# EAGLE board MKR_IMU_GPS_C_loop_v1 (2) (EAGLE 9.6.2)
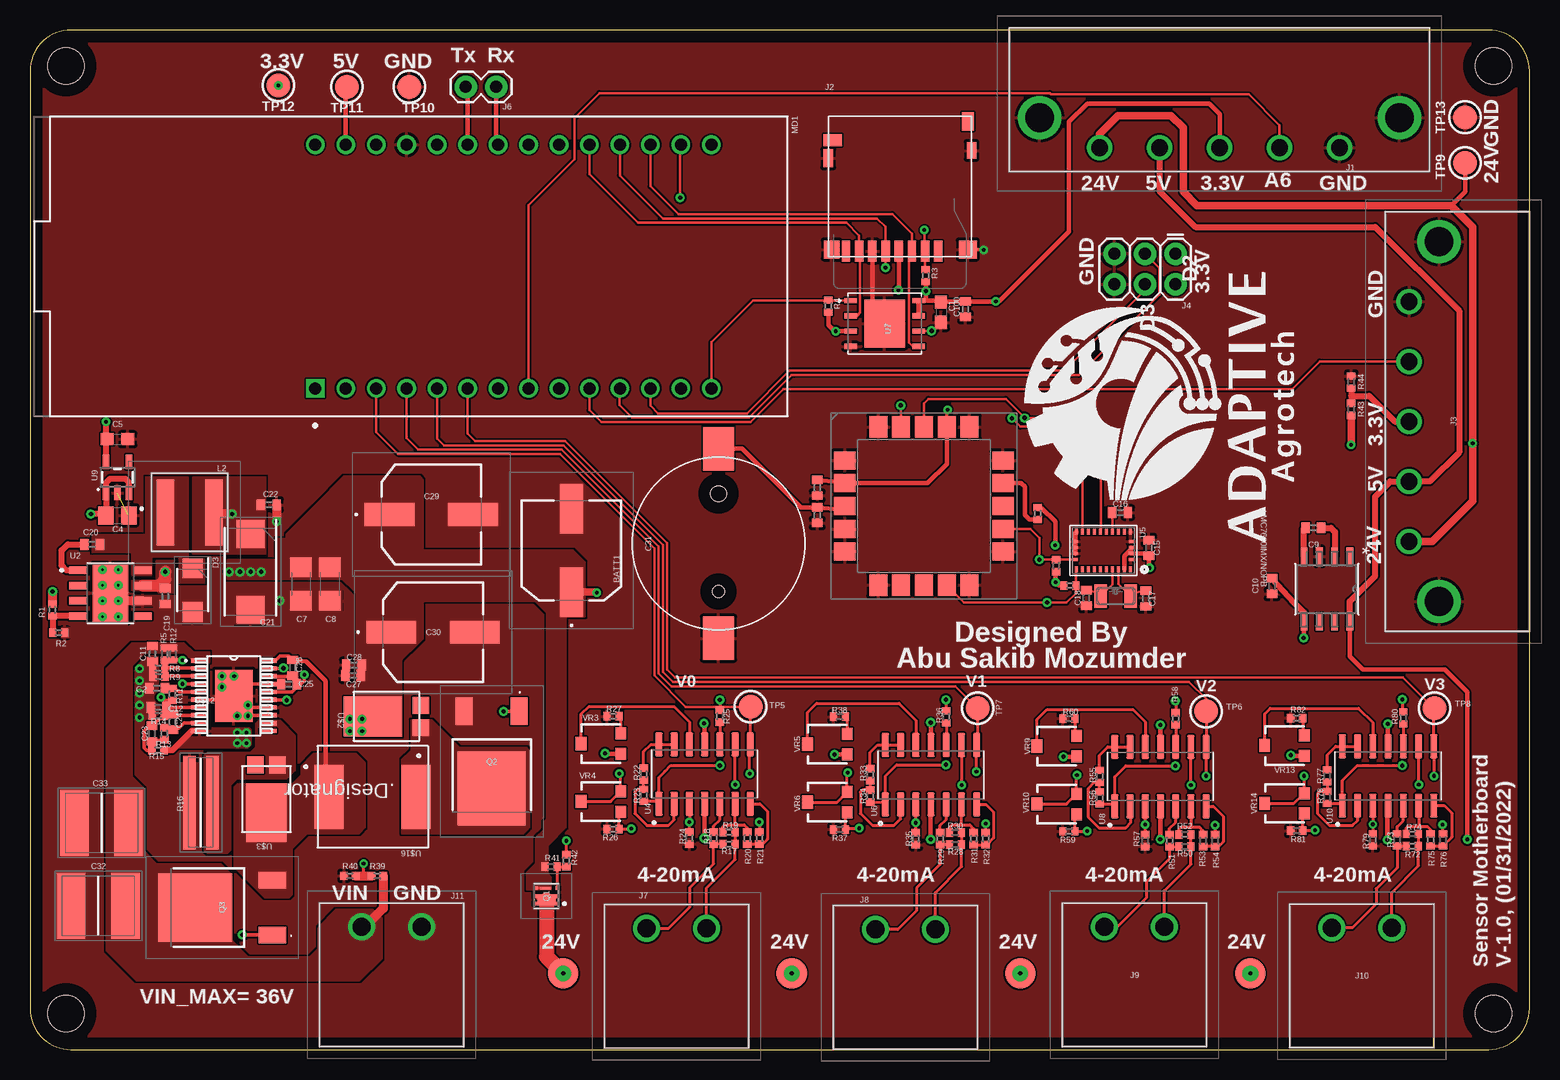
[diagram p5: board, top side]
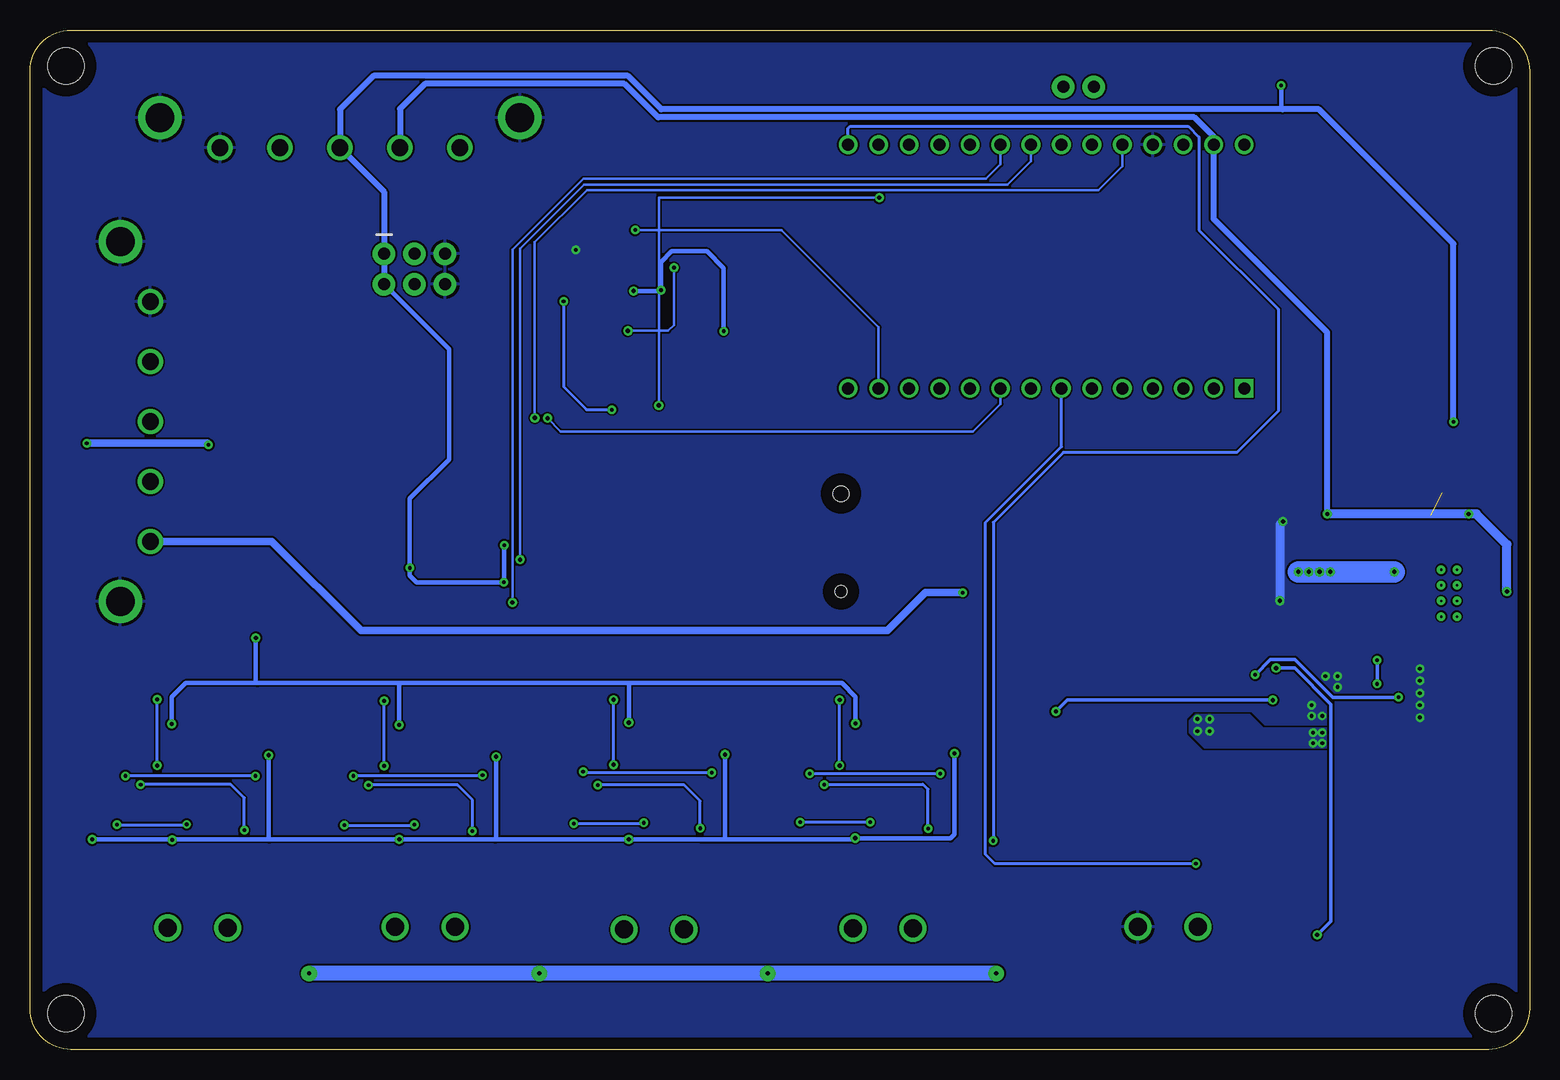
[diagram p6: board, bottom side, seen from below]

Size 125 x 85 mm. Coordinates in mm from the lower left corner, seen from the top.
Outline: 0,81.59 0,3.41 arc90 3.41,0 121.59,0 arc90 125,3.41 125,81.59 arc90 121.59,85 3.41,85 arc90 0,81.59
Copper layers (1*16): Top 0.035mm / dielectric 1.5mm / Bottom 0.035mm
Design rules "default *": minimum track width 6mil, minimum drill 0.3mm, track to track 6mil, track to pad 6mil, pad to pad 6mil, via to via 6mil, smd to smd 6mil, copper to edge 40mil, drill to drill 6mil, minimum pad ring 10mil, minimum via ring 8mil, stop-mask expansion 4mil, vias tented up to drill 20mil, thermal gap 10mil
Holes 3 mm at 3,82 122,82 122,3 3,3

## Footprints (pad centres in the part's own frame; a part is rotated, then mirrored left to right if it is on the bottom)
BATT-HOLDER_12MM = smd 3.6 x 2.6: P$1 -7.9,0; P$2 7.9,0 | hole 1: -4,0 | hole 1.3: 4.15,0
C0603 = smd 1.1 x 1: 1 -0.85,0; 2 0.85,0
C0402 = smd 0.7 x 0.9: 1 -0.65,0; 2 0.65,0
C0805 = smd 1.3 x 1.5: 1 -0.95,0; 2 0.95,0
C1206 = smd 1.6 x 1.8: 1 -1.4,0; 2 1.4,0
CAPPM7343X400N = smd 2.3 x 2.35: 1 -3.15,0; 2 3.15,0
16SVF270M = smd 4.15 x 1.9: 1 -3.475,0; 2 3.475,0
CAPC6050X550N = smd 2.39 x 5.51: 1 -2.26,0; 2 2.26,0
SODFL4626X130N = smd 1.66 x 1.63: 1 -1.825,0; 2 1.825,0
UBLOXLIB_SAM-M8Q = smd 1.8 x 1.5: 1 -6.6,3.8; 2 -6.6,1.9; 3 -6.6,0; 4 -6.6,-1.9; 5 -6.6,-3.8; 11 6.6,-3.8; 12 6.6,-1.9; 13 6.6,0; 14 6.6,1.9; 15 6.6,3.8 | smd 1.5 x 1.8: 6 -3.8,-6.6; 7 -1.9,-6.6; 8 0,-6.6; 9 1.9,-6.6; 10 3.8,-6.6; 16 3.8,6.6; 17 1.9,6.6; 18 0,6.6; 19 -1.9,6.6; 20 -3.8,6.6
1924004 = drill 1.4 pad 2.1: 1 0,0; 2 5,0; 3 10,0; 4 15,0; 5 20,0 | drill 2.4 pad 3.6: MH1 -5,-2.5; MH2 25,-2.5
AMPHENOL_114-00841-68 = smd 0.7 x 1.75: 1 3.2,-5.888; 2 2.1,-5.888; 3 1,-5.888; 4 -0.1,-5.888; 5 -1.2,-5.888; 6 -2.3,-5.888; 7 -3.4,-5.888; 8 -4.5,-5.888 | smd 1 x 1.55: CD1 5.65,4.912 | smd 1.55 x 1: CD2 -5.602,3.337 | smd 1.3 x 1.5: SH1 -5.7,-5.76 | smd 1.5 x 1.5: SH2 5.65,-5.76 | smd 0.8 x 1.4: SH3 5.975,2.487 | smd 0.8 x 1.5: SH4 -5.975,1.837
2X3 = drill 1.016 pad 1.88: 1 0,0; 2 0,2.54; 3 2.54,0; 4 2.54,2.54; 5 5.08,0; 6 5.08,2.54
1X02 = drill 1.016 pad 1.88: 1 0,0; 2 2.54,0
7966442 = drill 1.5 pad 2.25: 1 0,0; 2 5,0
XAL6060153MEC = smd 1.43 x 5.5: 1 -2.02,0; 2 2.02,0
ARDUINO_MKR_WIFI_1010_0 = drill 1 pad 1.55 square: 1 -7.97,-10.16 | drill 1 pad 1.55: 2 -5.43,-10.16; 3 -2.89,-10.16; 4 -0.35,-10.16; 5 2.19,-10.16; 6 4.73,-10.16; 7 7.27,-10.16; 8 9.81,-10.16; 9 12.35,-10.16; 10 14.89,-10.16; 11 17.43,-10.16; 12 19.97,-10.16; 13 22.51,-10.16; 14 25.05,-10.16; 15 25.05,10.16; 16 22.51,10.16; 17 19.97,10.16; 18 17.43,10.16; 19 14.89,10.16; 20 12.35,10.16; 21 9.81,10.16; 22 7.27,10.16; 23 4.73,10.16; 24 2.19,10.16; 25 -0.35,10.16; 26 -2.89,10.16; 27 -5.43,10.16; 28 -7.97,10.16
SQA403EJT1_GE3 = smd 0.3 x 0.35: 1 -0.65,-0.925; 2 0,-0.925; 3 0.65,-0.925; 4 0.65,0.925; 5 0,0.925; 6 -0.65,0.925 | smd 0.235 x 0.87: 7 0.65,0.04 | smd 0.95 x 1.5: 8 -0.325,0
SUD23N0631GE3 = smd 1.397 x 2.286: 1 -2.286,-4.222; 3 2.286,-4.222 | smd 5.69 x 6.18: 2 0,2.213
R0402 = smd 0.6 x 0.7: 1 -0.5,0; 2 0.5,0
RESC2075X70N = smd 1.05 x 7.8: 1 -0.95,0; 2 0.95,0
PAD.03X.05 = smd 2.54 x 2.54: 1 0,0
TESTPOINT_ROUND_2MM = smd 2 x 2: P$1 0,0
CONV_TPS5450DDAR = smd 1.55 x 0.6: 1 -2.7,1.905; 2 -2.7,0.635; 3 -2.7,-0.635; 4 -2.7,-1.905; 5 2.7,-1.905; 6 2.7,-0.635; 7 2.7,0.635; 8 2.7,1.905 | smd 2.95 x 4.9: 9 0,0 | drill 0.2 pad 0.3: 10 -0.65,1.95; 11 0.65,1.95; 12 -0.65,0.65; 13 0.65,0.65; 14 -0.65,-0.65; 15 0.65,-0.65; 16 -0.65,-1.95; 17 0.65,-1.95
M08A_TEX = smd 1.46 x 0.559: 1 -2.724,1.905; 2 -2.724,0.635; 3 -2.724,-0.635; 4 -2.724,-1.905; 5 2.724,-1.905; 6 2.724,-0.635; 7 2.724,0.635; 8 2.724,1.905
SOIC127P600X175-14N = smd 1.97 x 0.6: 1 -2.475,3.81; 2 -2.475,2.54; 3 -2.475,1.27; 4 -2.475,0; 5 -2.475,-1.27; 6 -2.475,-2.54; 7 -2.475,-3.81; 8 2.475,-3.81; 9 2.475,-2.54; 10 2.475,-1.27; 11 2.475,0; 12 2.475,1.27; 13 2.475,2.54; 14 2.475,3.81
BNO055 = smd 0.25 x 0.475: 1 -2.25,1.562; 6 -2.25,-1.562; 7 -1.75,-1.562; 8 -1.25,-1.562; 9 -0.75,-1.562; 10 -0.25,-1.562; 11 0.25,-1.562; 12 0.75,-1.562; 13 1.25,-1.562; 14 1.75,-1.562; 15 2.25,-1.562; 20 2.25,1.562; 21 1.75,1.562; 22 1.25,1.562; 23 0.75,1.562; 24 0.25,1.562; 25 -0.25,1.562; 26 -0.75,1.562; 27 -1.25,1.562; 28 -1.75,1.562 | smd 0.375 x 0.25: 2 -2.312,0.75; 3 -2.312,0.25; 4 -2.312,-0.25; 5 -2.312,-0.75; 16 2.312,-0.75; 17 2.312,-0.25; 18 2.312,0.25; 19 2.312,0.75
SON9P127_500X600X80L60X41T340X400N = smd 0.44 x 1.06: 1 -1.905,-2.835; 2 -0.635,-2.835; 3 0.635,-2.835; 4 1.905,-2.835; 5 1.905,2.835; 6 0.635,2.835; 7 -0.635,2.835; 8 -1.905,2.835 | smd 4 x 3.4: 9 0,0
SOT23-5 = smd 0.55 x 1.2: 1 -0.95,-1.3; 2 0,-1.3; 3 0.95,-1.3; 4 0.95,1.3; 5 -0.95,1.3
POWERDI5 = smd 1.397 x 1.397: 1 -0.92,-2.857; 3 0.92,-2.857 | smd 3.353 x 4.851: 2 0,1.13
MXA20A = smd 1.422 x 0.356: 1 -2.845,2.925; 2 -2.845,2.275; 3 -2.845,1.625; 4 -2.845,0.975; 5 -2.845,0.325; 6 -2.845,-0.325; 7 -2.845,-0.975; 8 -2.845,-1.625; 9 -2.845,-2.275; 10 -2.845,-2.925; 11 2.845,-2.925; 12 2.845,-2.275; 13 2.845,-1.625; 14 2.845,-0.975; 15 2.845,-0.325; 16 2.845,0.325; 17 2.845,0.975; 18 2.845,1.625; 19 2.845,2.275; 20 2.845,2.925 | smd 3.15 x 4.343: 21 0,0
WE-LHMI_8040 = smd 2.42 x 5.33: 1 -3.62,0; 2 3.62,0
TRIMPOT-SMD-3MM-CLOSED = smd 1 x 0.9: 1 -0.85,-1.65; 3 0.85,-1.65 | smd 1.1 x 0.9: 2 0,1.65
ABS07 = smd 1.1 x 1.9: 1 -1.25,0; 2 1.25,0

## Placement (x,y rotation side)
BATT1  BATT-HOLDER_12MM  [BATT-HOLDER_12MM]  57.4,42.18 90 top
C1  10uF  [C0603]  75.95,61.47 270 top
C2  470pF  [C0402]  10.59,30.12 180 top
C4  1.0uF  [C0805]  7.29,44.53 0 top
C5  2.2uF  [C0603]  7.29,50.88 0 top
C7  UMK316ABJ475KL8T  [C1206]  22.58,38.81 270 top
C8  UMK316ABJ475KL8T  [C1206]  24.99,38.81 270 top
C9  10uF  [C0402]  106.98,43.5 180 top
C10  10uF  [C0402]  103.54,38.64 90 top
C11  100nF  [C0402]  10.21,32.99 270 top
C12  22nF  [C0402]  10.72,28.52 180 top
C13  100n  [C0402]  65.63,46.84 270 top
C14  100n  [C0402]  65.63,44.55 270 top
C15  100n  [C0402]  93.27,41.82 90 top
C16  100n  [C0402]  90.87,44.76 0 top
C17  [C0402]  93.01,37.59 90 top
C18  [C0402]  88.06,37.64 90 top
C19  UMF105B7103KVHF  [C0402]  11.28,37.8 270 top
C20  UMF105B7103KVHF  [C0402]  5.18,42.11 0 top
C21  10TPB330M  [CAPPM7343X400N]  18.39,39.83 270 top
C22  UMF105B7103KVHF  [C0402]  19.91,45.42 0 top
C23  33nF  [C0402]  10.16,26.34 90 top
C24  470pF  [C0402]  11.89,27.3 90 top
C25  1uF  [C0402]  21.59,30.45 180 top
C26  100NnF  [C0402]  21.89,31.83 90 top
C27  470nF  [C0402]  26.95,31.19 180 top
C28  470nF  [C0402]  27,32.05 180 top
C29  50SVPF18M  [16SVF270M]  33.45,44.6 0 top
C30  50SVPF18M  [16SVF270M]  33.6,34.8 0 top
C31  50SVPF18M  [16SVF270M]  45.14,41.61 90 top
C32  CKG57NX5R1H226M500JH  [CAPC6050X550N]  5.69,11.99 0 top
C33  CKG57NX5R1H226M500JH  [CAPC6050X550N]  5.97,18.9 0 top
C100  100nF  [C0402]  77.98,61.72 90 top
D3  SS54F  [SODFL4626X130N]  13.56,38.3 270 top
IC2  SAM-M8Q  [UBLOXLIB_SAM-M8Q]  74.52,45.31 0 top
J1  1924004  [1924004]  109.16,75.18 180 top
J2  -  [AMPHENOL_114-00841-68]  72.52,72.47 0 top
J3  1924004  [1924004]  114.97,42.35 90 top
J4  FEMALE 2x3  [2X3]  95.48,66.34 180 top
J6  [1X02]  38.86,80.26 180 top
J7  796644-2  [7966442]  51.41,10.11 0 top
J8  796644-2  [7966442]  70.46,10.01 0 top
J9  796644-2  [7966442]  89.56,10.21 0 top
J10  796644-2  [7966442]  108.51,10.16 0 top
J11  796644-2  [7966442]  27.66,10.21 0 top
L2  XAL6060-153MEC  [XAL6060153MEC]  13.31,44.78 0 top
MD1  ARDUINO_MKR_WIFI_1010ARDUINO_MKR_WIFI_1010_0_0  [ARDUINO_MKR_WIFI_1010_0]  31.75,65.28 0 top
Q1  SQA403EJ-T1_GE3  [SQA403EJT1_GE3]  43.05,12.8 90 top
Q2  SUD23N06-31-GE3  [SUD23N0631GE3]  38.48,23.98 180 top
Q3  SUD23N06-31-GE3  [SUD23N0631GE3]  15.98,11.84 90 top
R1  10K  [R0402]  1.88,36.65 90 top
R2  3.16K  [R0402]  2.39,34.75 180 top
R3  10K  [R0402]  74.68,64.52 270 top
R4  10K  [R0402]  66.55,61.98 270 top
R5  36.5K  [R0402]  11.23,32.97 90 top
R6  10K  [R0402]  86.68,38.68 180 top
R7  10K  [R0402]  85.54,40.33 270 top
R8  6.49K  [R0402]  10.72,31.8 0 top
R9  10K  [R0402]  10.74,31.09 0 top
R10  100k  [R0402]  84.01,44.69 90 top
R11  105K  [R0402]  11.86,29.62 270 top
R12  1m  [R0402]  11.91,32.97 90 top
R13  12.1K  [R0402]  11.2,26.34 90 top
R14  1K  [R0402]  10.69,27.84 180 top
R15  18.7K  [R0402]  10.67,24.94 180 top
R16  10m  [RESC2075X70N]  14.25,20.6 180 top
R17  100R  [R0402]  58.27,17.12 180 top
R18  10K  [R0402]  57,17.63 270 top
R19  10K  [R0402]  58.27,18.14 0 top
R20  10K  [R0402]  59.79,17.63 90 top
R21  10K  [R0402]  60.81,17.63 270 top
R22  10K  [R0402]  51.16,22.96 90 top
R23  10K  [R0402]  51.16,21.18 90 top
R24  10K  [R0402]  54.97,17.63 270 top
R25  10K  [R0402]  57.51,27.79 90 top
R26  10K  [R0402]  48.62,18.39 180 top
R27  200R  [R0402]  48.62,27.79 0 top
R28  100R  [R0402]  77.14,17.07 180 top
R29  10K  [R0402]  75.87,17.58 270 top
R30  10K  [R0402]  77.14,18.08 0 top
R31  10K  [R0402]  78.66,17.58 90 top
R32  10K  [R0402]  79.68,17.58 270 top
R33  10K  [R0402]  70.03,22.91 90 top
R34  10K  [R0402]  70.03,21.13 90 top
R35  10K  [R0402]  73.84,17.58 270 top
R36  10K  [R0402]  76.38,27.74 90 top
R37  10K  [R0402]  67.49,18.34 180 top
R38  200R  [R0402]  67.49,27.74 0 top
R39  1M  [R0402]  28.96,14.48 0 top
R40  75K  [R0402]  26.67,14.48 0 top
R41  10K  [R0402]  43.43,15.24 0 top
R42  470R  [R0402]  44.7,15.75 90 top
R43  820K  [R0402]  110.14,53.37 270 top
R44  120K  [R0402]  110.14,55.66 270 top
R50  100R  [R0402]  96.27,16.92 180 top
R51  10K  [R0402]  95,17.42 270 top
R52  10K  [R0402]  96.27,17.93 0 top
R53  10K  [R0402]  97.79,17.42 90 top
R54  10K  [R0402]  98.81,17.42 270 top
R55  10K  [R0402]  89.15,22.76 90 top
R56  10K  [R0402]  89.15,20.98 90 top
R57  10K  [R0402]  92.96,17.42 270 top
R58  10K  [R0402]  95.5,27.58 90 top
R59  10K  [R0402]  86.61,18.19 180 top
R60  200R  [R0402]  86.61,27.58 0 top
R72  100R  [R0402]  115.24,16.97 180 top
R73  10K  [R0402]  113.97,17.48 270 top
R74  10K  [R0402]  115.24,17.98 0 top
R75  10K  [R0402]  116.76,17.48 90 top
R76  10K  [R0402]  117.78,17.48 270 top
R77  10K  [R0402]  108.13,22.81 90 top
R78  10K  [R0402]  108.13,21.03 90 top
R79  10K  [R0402]  111.94,17.48 270 top
R80  10K  [R0402]  114.48,27.64 90 top
R81  10K  [R0402]  105.59,18.24 180 top
R82  200R  [R0402]  105.59,27.64 0 top
TP1  TEST-POINT3X5  [PAD.03X.05]  44.45,6.35 0 top
TP2  TEST-POINT3X5  [PAD.03X.05]  63.5,6.35 0 top
TP3  TEST-POINT3X5  [PAD.03X.05]  82.55,6.35 0 top
TP4  TEST-POINT3X5  [PAD.03X.05]  101.73,6.35 0 top
TP5  [TESTPOINT_ROUND_2MM]  60.07,28.57 0 top
TP6  [TESTPOINT_ROUND_2MM]  98.04,28.19 0 top
TP7  [TESTPOINT_ROUND_2MM]  78.99,28.45 0 top
TP8  [TESTPOINT_ROUND_2MM]  117.09,28.45 0 top
TP9  [TESTPOINT_ROUND_2MM]  119.63,73.91 0 top
TP10  [TESTPOINT_ROUND_2MM]  31.62,80.26 0 top
TP11  [TESTPOINT_ROUND_2MM]  26.42,80.26 0 top
TP12  [TESTPOINT_ROUND_2MM]  20.7,80.39 0 top
TP13  [TESTPOINT_ROUND_2MM]  119.63,77.72 0 top
U2  TPS5450DDAR  [CONV_TPS5450DDAR]  6.71,38.05 0 top
U3  LMC7660IMX/NOPB  [M08A_TEX]  108.11,38.39 270 top
U4  LM324  [SOIC127P600X175-14N]  56.24,22.96 90 top
U5  BNO055  [BNO055]  89.48,41.6 180 top
U6  LM324  [SOIC127P600X175-14N]  75.11,22.91 90 top
U7  W25Q16  [SON9P127_500X600X80L60X41T340X400N]  71.25,60.53 270 top
U8  LM324  [SOIC127P600X175-14N]  94.23,22.76 90 top
U9  AP2112K-3.3V  [SOT23-5]  7.29,47.7 0 top
U10  LM324  [SOIC127P600X175-14N]  113.21,22.81 90 top
U$2  PDS760-13  [POWERDI5]  29.72,27.76 90 top
U$3  PDS760-13  [POWERDI5]  19.71,20.88 180 top
U$12  LM25118MH/NOPB  [MXA20A]  16.99,29.49 0 top
U$16  74437358082  [WE-LHMI_8040]  28.57,21.06 180 top
VR3  10k  [TRIMPOT-SMD-3MM-CLOSED]  47.6,25.5 90 top
VR4  100K  [TRIMPOT-SMD-3MM-CLOSED]  47.6,20.68 90 top
VR5  10k  [TRIMPOT-SMD-3MM-CLOSED]  66.47,25.45 90 top
VR6  100K  [TRIMPOT-SMD-3MM-CLOSED]  66.47,20.62 90 top
VR9  10k  [TRIMPOT-SMD-3MM-CLOSED]  85.6,25.3 90 top
VR10  100K  [TRIMPOT-SMD-3MM-CLOSED]  85.6,20.47 90 top
VR13  10k  [TRIMPOT-SMD-3MM-CLOSED]  104.57,25.35 90 top
VR14  100K  [TRIMPOT-SMD-3MM-CLOSED]  104.57,20.52 90 top
Y2  32768Hz  [ABS07]  90.49,37.79 180 top

## Tracks (layer width: path | path; a pad name or v marks a point on that pad's centre or on a via)
3.3V  (via drill 0.3, 0.35)
  Top 0.254: IC2.17 76.42,53.27 v76.49,53.34
  Top 0.381: C13.1 67.85,47.29 IC2.2 74.83,47.21 76.42,48.8 IC2.17 | U5.4 91.79,41.7 | 91.79,41.7 U5.3 93.23,41.35 C15.1 93.27,40.22 v93.35,40.15 | R6.2 85.77,38.68 v85.5,38.95 85.5,39.78 R7.2 | U5.28 91.23,41.13 91.79,41.7 | U7.7 U7.8 74.62,62.43 | 74.62,62.43 75.74,62.43 C1.1 76,62.37 C100.2 80.52,62.37 v80.52,62.39 80.8,62.39 86.61,68.2 86.61,77.34 88.14,78.87 98.3,78.87 99.19,77.98 99.19,75.21 J1.3 | R3.2 v74.68,63.25 74.68,62.48 74.62,62.43 | R4.2 66.55,60.4 67.06,59.89 v67.18,59.89 U7.3 | J2.4 72.42,63.35 v72.39,63.32 | R10.2 84.02,45.15 84.33,45.15 85.47,44 v85.47,42.05
  Top 0.508: U9.5 6.34,50.78 C5.1 6.35,50.97 v6.35,52.32
  Bottom 0.254: v80.52,62.39 80.52,55.26 78.61,53.34 v76.49,53.34
  Bottom 0.381: v74.68,63.25 72.47,63.25 v72.39,63.32 72.39,65.66 71.5,66.55 68.58,66.55 67.18,65.15 v67.18,59.89 | v85.47,42.05 85.47,38.98 v85.5,38.95 92.79,38.95 93.35,39.51 v93.35,40.15 93.35,45.92 90.06,49.2 90.06,58.38 J4.2 | 20.57,78.38 20.7,78.51 TP12.P$1
  Bottom 0.508: v6.35,52.32 6.35,67.18 17.55,78.38 20.57,78.38 72.37,78.38 75.16,81.18 96.37,81.18 99.16,78.39 J1.3 95.48,71.5 J4.1 J4.2
  other vias: 20.7,80.39
5V  (via drill 0.35)
  Top 0.381: U4.4 56.21,20.46 v56.21,17.63 | v113.16,17.48 113.16,20.28 U10.4 | U6.4 75.08,20.41 v75.08,17.52 | U8.4 94.23,17.53 v94.22,17.52 | VR3.1 47.97,24.65 v47.93,24.69 | VR5.1 v67.07,24.6 v67.06,24.59 | VR9.1 87.21,24.41 v86.16,24.41 | VR13.1 105.14,24.5 v105.11,24.54 | U3.8 110.01,32.79 111.1,31.7 117.93,31.7 119.81,29.82 v119.81,17.53 | MD1.27 26.32,80.17 TP11.P$1
  Top 0.508: U9.3 8.24,47.26 8.2,47.3 8.2,47.35 7.95,47.6 6.68,47.6 6.34,47.26 U9.1 6.34,44.58 C4.1 6.26,44.65 v5.08,44.65 | U3.8 110.01,37.37 112.14,39.5 112.14,46.1 113.39,47.35 J3.2 116.7,47.35 119.13,49.78 119.13,61.59 112.14,68.58 97.16,68.58 94.16,71.58 J1.4
  Top 0.762: R1.2 v1.88,38.18 | v16.87,44.65 15.46,44.65 L2.2
  Bottom 0.381: 67.08,17.53 69.04,17.53 69.05,17.52 v75.08,17.52 86.21,17.52 | 67.08,17.53 56.31,17.53 v56.21,17.63 56.19,17.6 48.26,17.6 47.93,17.93 v47.93,24.69 | 86.21,17.52 v94.22,17.52 105.05,17.52 | 105.05,17.52 113.12,17.52 v113.16,17.48 113.21,17.53 v119.81,17.53 | v67.06,24.59 67.06,17.55 67.08,17.53 | v86.16,24.41 86.16,17.57 86.21,17.52 | v105.11,24.54 105.11,17.57 105.05,17.52
  Bottom 0.508: v16.87,44.65 16.87,59.79 26.32,69.25 MD1.27 26.32,76.1 27.94,77.72 72.64,77.72 75.44,80.52 92.08,80.52 94.16,78.43 J1.4
  Bottom 0.762: v1.88,38.18 1.88,42.11 4.42,44.65 v5.08,44.65 v16.87,44.65
  pour Top (no thermals): 13.56,47.7 13.56,41.35 19.66,41.35 19.66,47.7
24V  (via drill 0.3, 0.35)
  Top 0.254: Q1.7 Q1.4
  Top 0.381: TP9.P$1 119.63,71.5 118.49,70.36
  Top 0.508: U$12.10 13.48,26.56 11.86,24.94 R15.1
  Top 0.635: J1.5 89.16,76.33 90.68,77.85 95.12,77.85 96.14,76.83 96.14,71.5 97.28,70.36 118.49,70.36 120.27,68.58 v120.27,50.55 120.27,45.72 116.9,42.35 J3.1 | R43.2 110.14,50.45 v110.11,50.42 | C31.1 47.21,38.13 v47.24,38.1
  Top 1.016: U2.7 10.77,38.68 11.28,39.19 v11.28,39.83
  Bottom 0.635: v110.11,50.42 110.24,50.55 v120.27,50.55 | v47.24,38.1 50.35,38.1 53.52,34.92 97.41,34.92 104.84,42.35 J3.1
  Bottom 1.778: v11.28,39.83 v19.28,39.83
  other vias: 18.39,39.83 17.5,39.83 16.61,39.83 17.27,26.42 18.03,26.42 17.27,25.53 18.03,25.53 26.67,27.56 26.67,26.54 27.69,26.54 27.69,27.56
  pour Top (no thermals): 8.48,38.3 10.52,38.3 10.72,38.1 12.04,38.1 12.04,40.72 10.52,40.72 10.52,39.07 8.48,39.07
  pour Top (no thermals): 26.26,39.19 16.48,39.19 16.48,40.84 20.55,40.84 20.55,42.62 26.26,42.62
  pour Top (no thermals): 32.51,47.75 26.16,47.75 23.88,45.47 21.34,42.93 21.34,39.37 25.91,39.37 27.18,38.1 27.18,26.16 30.99,26.16 30.99,32.51 32.26,33.78 32.77,34.29 32.77,47.24 32.77,47.5
  pour Top (no thermals): 46.23,36.07 43.43,36.07 42.16,37.34 31.24,37.34 31.24,41.4 31.5,41.66 45.21,41.66 45.97,40.89 46.23,40.64
  pour Top (no thermals): 41.4,13.34 43.43,13.34 43.43,14.35 43.18,14.61 43.18,17.02 44.7,18.54 44.7,38.35 44.45,38.61 43.05,38.61 43.05,19.18 42.8,18.92 42.8,18.29 42.16,17.65 42.16,15.49 41.4,14.73
  pour Top: 13.72,26.8 18.29,26.8 18.41,26.67 18.41,25.4 18.16,25.15 12.32,25.15 12.32,25.4
  pour Bottom: 16.89,26.8 16.89,25.15 27.05,25.15 28.32,26.42 28.32,27.43 27.81,27.94 23.37,27.94 22.23,26.8
24V_CTRL  (via drill 0.3)
  Top 0.254: v44.7,17.4 R42.2
  Bottom 0.254: MD1.15 56.8,76.8 56.64,76.96 28.45,76.96 27.56,76.07 27.56,68.33 20.95,61.72 20.95,53.21 24.38,49.78 38.86,49.78 44.7,43.94 v44.7,17.4
24V_OUT  (via drill 0.35 pad 1.3)
  Top 0.254: Q1.5 42.45,12.48 42.9,12.48 | 42.9,12.48 Q1.8 | Q1.2 43.65,12.48 Q1.8 | Q1.1 43.23,12.15 42.9,12.48 | Q1.6 42.73,12.15 Q1.8
  Top 1.27: Q1.8 43.05,7.75 TP1.1
  Bottom 1.27: TP1.1 TP2.1 TP3.1 TP4.1
  other vias: 44.45,6.35 101.73,6.35 82.55,6.35 63.5,6.35
-5V  (via drill 0.35)
  Top 0.381: U4.11 56.24,27.13 v56.19,27.18 | v113.18,27.15 113.21,27.13 U10.11 | U6.11 75.11,27.23 v75.08,27.25 | U8.11 v94.23,27.05 | U3.5 106.2,34.35 v106.17,34.31
  Top 0.508: C10.2 105.41,37.24 106.2,36.44 U3.5
  Bottom 0.381: v56.19,27.18 56.19,29.41 57.33,30.56 75.11,30.56 | v113.18,27.15 113.18,29.39 112.01,30.56 106.05,30.56 | 75.11,30.56 94.21,30.56 | 94.21,30.56 106.05,30.56 | v75.08,27.25 75.08,30.53 75.11,30.56 | v94.23,27.05 94.23,30.53 94.21,30.56 | v106.17,34.31 106.17,30.68 106.05,30.56
CLK  (via drill 0.35)
  Top 0.203: MD1.18 49.18,72.87 52.76,69.29 70.61,69.29 71.32,68.59 J2.5 v71.32,65.18 | U7.6 75.13,59.89 v75.16,59.92
  Bottom 0.203: v75.16,59.92 71.81,59.92 71.32,60.4 v71.32,65.18
D2
  Top 0.203: J4.3 94.15,65.14 94.15,62.93 87.45,56.24 63.48,56.24 59.92,52.68 50.19,52.68 49.15,53.72 49.15,55.09 MD1.11
D3
  Top 0.203: J4.4 92.94,63.32 86.21,56.59 63.33,56.59 59.78,53.03 52.38,53.03 51.72,53.69 MD1.12
GND  (via drill 0.3, 0.35)  (1 unrouted)
  Top 0.152: 8.24,37.41 8.16,37.41 7.53,38.05 6.83,38.05 | 6.83,38.05 U2.9 | 6.83,38.05 6.83,37.7 6.77,37.64 6.77,35.86 6.83,35.81
  Top 0.305: C25.2 21.07,30.46 U$12.17 17.97,30.46 U$12.21 | U$12.14 17.97,28.51 U$12.21 | U$12.13 18.62,27.86 U$12.21 | U$12.6 16.67,29.16 U$12.21 | J2.SH2 79.47,66.71 v79.5,66.67
  Top 0.381: J2.6 70.22,61.56 U7.9 | U5.18 U5.16 87.17,43.1 U5.15
  Top 0.762: C22.2 20.56,44.03 v20.55,44.02 | U2.6 8.24,37.41 | 6.71,38 U2.9 6.75,38.05
  Bottom 0.762: v20.55,44.02 20.8,43.76 v20.8,37.41
  other vias: 9.14,31.75 9.14,30.73 9.14,29.72 9.14,28.7 9.14,27.69 16,31.11 17.02,31.11 17.27,27.81 18.16,27.81 16,30.23 18.16,28.7
  pour Top (no thermals): 26.01,38.56 20.17,38.56 19.91,38.3 16.61,38.3 16.1,37.8 8.48,37.8 8.48,37.03 10.26,37.03 10.77,36.53 11.79,36.53 12.55,35.76 12.55,35.51 26.01,35.51
  pour Top (no thermals): 2.64,34.37 7.34,34.37 8.1,35.13 8.1,40.46 5.31,40.46 5.31,35.64 4.8,35.13 2.64,35.13
  pour Top (no thermals): 9.78,32.72 10.67,32.72 10.67,28.07 10.16,27.56 9.78,27.56 9.65,27.43 9.65,24.38 10.16,23.88 13.97,23.88 13.97,16.51 13.34,15.88 10.67,15.88 9.91,16.64 9.91,21.84 8.81,22.94 8.81,31.75
  pour Bottom (rank 2): -7.62,88.9 142.24,88.9 142.24,7.62 142.24,-25.4 76.2,-25.4 -7.62,-25.4
  pour Top (rank 2): -7.62,88.9 142.24,88.9 142.24,-22.86 -7.62,-22.86
  pour Top (no thermals): 34.29,47.24 34.29,42.67 46.48,42.67 46.48,47.24 46.48,48.01 34.29,48.01
  pour Top (no thermals): 34.29,36.58 34.29,28.19 35.05,27.43 35.05,26.67 37.34,26.67 37.34,32.77 39.62,32.77 39.62,36.58
  pour Top (no thermals): 1.52,22.1 1.52,8.38 5.33,8.38 5.33,22.1
  pour Top (no thermals): 31.24,12.19 31.24,8.38 35.05,8.38 35.05,12.19
GPS_EXTINT  (via drill 0.35)
  Top 0.203: IC2.19 72.62,53.66 v72.58,53.7 | v54.2,71.02 54.2,75.38 MD1.16
  Bottom 0.203: v72.58,53.7 72.58,71.02 v54.2,71.02
IMU_INT  (via drill 0.35)
  Top 0.203: U5.14 87.73,49.73 85.53,51.93 82.56,51.93 v81.85,52.63
  Bottom 0.203: v81.85,52.63 80.76,51.54 46.38,51.54 44.1,53.82 MD1.9
MISO
  Top 0.203: MD1.19 46.64,72.97 50.67,68.94 68.05,68.94 69.12,67.86 J2.7 69.2,66.5 69.2,61.42 68.94,61.16 U7.2
MOSI
  Top 0.203: MD1.17 51.72,71.98 54.05,69.65 71.88,69.65 73.52,68.01 73.52,66.85 | 73.52,66.85 J2.3 | U7.5 73.58,58.62 73.28,58.93 73.28,66.61 73.52,66.85
N$1
  Top 0.305: R13.2 11.84,26.85 C24.1 12.45,26.8 12.86,27.21 U$12.9
N$2
  Top 0.305: R13.1 C23.1
N$3
  Top 0.305: U$12.8 11.94,27.86 C24.2 11.86,27.84 R14.1 11.15,27.84 C23.2 9.83,26.85 9.53,26.54 9.53,25.15 9.73,24.94 R15.2
N$4
  Top 0.305: C12.1 14.14,28.52 U$12.7
N$5
  Top 0.508: U2.1 3.02,39.95 2.64,40.34 2.64,41.6 3.15,42.11 C20.1
N$6
  pour Top (no thermals): 8.48,39.57 10.13,39.57 10.13,41.1 12.42,41.1 12.42,38.94 14.58,38.94 14.58,40.84 13.18,40.84 13.18,47.7 9.63,47.7 9.63,42.88 5.18,42.88 5.18,41.48 8.48,41.48
N$7
  Top 0.305: C2.1 R11.1 12.12,30.12 12.43,29.81 U$12.5
N$8
  Top 0.508: C9.1 108.44,43.5 108.79,43.15 108.79,41.15 U3.2
N$9
  Top 0.508: U3.4 106.2,43.46 C9.2
N$10
  Top 0.203: U5.27 90.73,38.81 Y2.1 92.05,38.1 C17.2
N$11
  Top 0.203: U5.26 90.23,38.78 Y2.2 88.89,38.15 C18.2
N$12
  Top 0.203: U5.9 90.23,44.71 C16.1
N$14  (via drill 0.3)
  Top 0.254: 27.94,14.48 27.81,14.61 v27.81,15.49
  Top 0.762: R40.2 27.94,14.48 R39.1
  Bottom 0.254: v27.81,15.49 44.58,15.49 45.34,16.26 45.34,43.94 39.02,50.26 MD1.7
N$15
  Top 0.508: R44.2 110.14,54.48 | 110.14,54.48 R43.1 | 110.14,54.48 111.63,54.48 113.76,52.35 J3.3
N$19
  Top 0.254: R17.2 R18.2 57,15.49 55.02,13.51 55.02,11.89 53.24,10.11 J7.1
N$20
  Top 0.254: R19.2 R17.1 58.78,15.85 56.41,13.48 J7.2
N$21
  Top 0.254: R18.1 57,18.64 57.51,19.15 U4.5
N$22
  Top 0.254: R19.1 57.76,18.59 57.91,18.75 58.88,18.75 | 58.88,18.75 59.54,18.75 59.79,18.49 R20.2 | 58.88,18.75 58.78,18.85 U4.6
N$23  (via drill 0.3)
  Top 0.254: U4.3 v54.97,18.95 R24.1 | v60.81,18.95 R21.1
  Bottom 0.254: v54.97,18.95 v60.81,18.95
N$24  (via drill 0.35)
  Top 0.254: R23.1 52.24,20.68 U4.1 52.43,22.68 52.78,23.04 52.93,23.19 53.41,23.67 v57.51,23.67 | v57.51,29.13 R25.2
  Bottom 0.254: v57.51,23.67 v57.51,29.13
N$25
  Top 0.254: VR3.2 45.95,27.97 46.58,28.6 53.7,28.6 54.97,27.33 U4.12
N$26
  Top 0.254: R27.2 49.25,27.66 VR3.3
N$27
  Top 0.254: R22.1 R23.2 50.65,21.69 50.42,21.46 50.42,19.68 51.44,18.67 53.21,18.67 53.7,19.15 U4.2
N$28
  Top 0.254: R25.1 U4.10
N$29  (via drill 0.3)
  Top 0.254: VR4.1 49.12,19.7 R26.1 49.15,18.41 v50.14,18.41 | v58.78,22.07 U4.9
  Bottom 0.254: v50.14,18.41 50.14,21.69 50.57,22.12 58.73,22.12 v58.78,22.07
N$30
  Top 0.508: U2.4 R1.1 R2.2
N$31  (via drill 0.3)
  Top 0.305: U$12.16 21.84,29.81 22.1,30.07 C25.1 22.58,30.45 22.86,30.73 v22.86,31.24 | R11.2 11.18,29.11 v10.92,29.37
  Bottom 0.305: v10.92,29.37 16.41,29.37 19.56,32.51 21.59,32.51 v22.86,31.24
N$32
  Top 0.254: R28.2 R29.2 75.87,15.42 73.91,13.46 73.91,11.58 72.34,10.01 J8.1
N$33
  Top 0.254: R30.2 R28.1 77.65,15.27 75.46,13.08 J8.2
N$34
  Top 0.254: R29.1 75.87,18.67 76.38,19.18 U6.5
N$35
  Top 0.254: R30.1 76.63,18.52 76.86,18.75 77.62,18.75 | 77.62,18.75 78.33,18.75 78.66,18.41 R31.2 | 77.62,18.75 77.65,18.77 U6.6
N$36  (via drill 0.3)
  Top 0.254: R35.1 v73.84,18.9 U6.3 | R32.1 79.68,18.82 v79.65,18.85
  Bottom 0.254: v79.65,18.85 73.89,18.85 v73.84,18.9
N$37  (via drill 0.35)
  Top 0.254: R34.1 71.11,20.62 U6.1 71.3,22.81 72.23,23.75 v76.35,23.75 | v76.35,29.16 76.35,28.27 R36.2
  Bottom 0.254: v76.35,23.75 v76.35,29.16
N$38
  Top 0.254: VR5.2 64.82,28.09 65.58,28.85 72.44,28.85 73.84,27.46 U6.12
N$39
  Top 0.254: R38.2 68.12,27.61 VR5.3
N$40
  Top 0.254: R33.1 R34.2 69.39,21.64 69.22,21.46 69.22,19.68 70.23,18.67 72.01,18.67 72.57,19.23 U6.2
N$41
  Top 0.254: R36.1 U6.10
N$42  (via drill 0.3)
  Top 0.254: 68.16,19.81 VR6.1 68,19.65 R37.1 68.1,18.44 v69.14,18.44 | v77.67,22.05 77.67,25.36 U6.9
  Bottom 0.254: v69.14,18.44 69.14,20.73 70.46,22.05 v77.67,22.05
N$43
  Top 0.305: R9.2 11.3,31.14 14.12,31.14 U$12.3
N$44
  Top 0.305: R8.2 14.11,31.8 U$12.2
  Top 0.381: R8.2 R5.1
N$45  (via drill 0.3)
  Top 0.305: R12.1 v12.7,32.46 | U$12.4 12.72,30.46 v12.7,30.48
  Bottom 0.305: v12.7,30.48 v12.7,32.46
N$46
  Top 0.203: MD1.8 41.56,70.39 45.38,74.21 45.38,77.64 47.48,79.73 85.01,79.73 85.12,79.63 101.6,79.63 104.16,77.07 J1.2
N$47
  Top 0.305: C26.1 21.69,31.11 U$12.18
N$48  (via drill 0.35)
  Top 0.305: U$12.19 21.09,31.76 v21.12,31.8 | v17.7,9.55 Q3.1
  Bottom 0.305: v21.12,31.8 19.58,31.8 16.56,28.78 16.56,10.69 v17.7,9.55
N$52
  Top 0.305: U$12.20 20.45,32.41 20.85,32.82 21.56,32.82 C26.2
  Top 0.381: C26.2 23.04,32.33 24.64,30.73 24.64,21.59 24.38,21.34 24.66,21.06 U$16.2
  pour Top (no thermals): 17.02,21.84 17.02,15.24 18.03,14.22 19.56,12.7 21.59,12.7 21.84,12.95 21.84,16.76 23.11,18.03 25.91,18.03 26.67,18.03 27.43,18.03 27.94,18.54 27.94,23.11 27.94,23.88 27.69,24.13 27.18,24.64 23.62,24.64 22.61,23.62 22.61,22.86 21.84,22.1 17.53,22.1 17.27,22.1
N$53
  pour Top (no thermals): 20.88,27.38 19.05,27.38 18.8,27.13 18.8,25.17 18.36,24.74 14.78,24.74 14.53,24.49 14.53,16.66 14.78,16.41 16.46,16.41 16.71,16.66 16.71,22.05 17.27,22.61 21.39,22.61 22.05,23.27 22.1,23.27 22.1,26.16
N$54
  Top 0.254: R50.2 R51.2 95,15.9 93.07,13.97 93.07,12.65 90.63,10.21 J9.1
N$55
  Top 0.254: R52.2 R50.1 96.77,15.44 94.56,13.23 J9.2
N$56
  Top 0.254: R51.1 95,18.44 95.5,18.95 U8.5
N$57
  Top 0.254: R52.1 95.76,18.34 95.96,18.54 96.83,18.54 | 96.83,18.54 97.48,18.54 97.79,18.24 R53.2 | U8.6 96.83,20.23 96.83,18.54
N$58  (via drill 0.3)
  Top 0.254: R57.1 v92.96,18.75 U8.3 | R54.1 v98.81,18.69
  Bottom 0.254: v98.81,18.69 93.02,18.69 v92.96,18.75
N$59  (via drill 0.35)
  Top 0.254: R56.1 90.23,20.47 U8.1 90.42,22.73 91.34,23.65 v95.48,23.65 | v95.48,29.06 95.5,29.03 R58.2
  Bottom 0.254: v95.48,23.65 v95.48,29.06
N$60
  Top 0.254: VR9.2 83.95,27.51 84.78,28.35 91.95,28.35 92.96,27.33 U8.12
N$61
  Top 0.254: R60.2 87.12,26.27 VR9.3
N$62
  Top 0.254: R56.2 R55.1 88.7,22.25 88.19,21.74 88.19,19.41 89.1,18.49 91.34,18.49 91.77,18.92 91.77,20.21 U8.2
N$63
  Top 0.254: R58.1 U8.10
N$64  (via drill 0.3)
  Top 0.254: VR10.1 87.12,19.5 R59.1 88.06,18.19 88.08,18.18 v88.11,18.21 | v96.77,22.05 U8.9
  Bottom 0.254: v88.11,18.21 88.11,20.8 89.36,22.05 v96.77,22.05
N$65  (via drill 0.35)
  Top 0.305: U$12.15 21.35,29.16 v21.39,29.13 | v39.47,28.19 Q2.1
  Bottom 0.305: v21.39,29.13 38.53,29.13 v39.47,28.19
N$66
  pour Top (no thermals): 31.75,27.43 31.75,26.16 31.75,24.89 30.99,24.13 30.99,18.03 41.15,18.03 41.4,18.29 41.66,18.54 41.66,24.89 41.4,25.15 38.86,25.15 35.81,25.15 35.05,25.91 33.53,27.43
N$76
  Top 0.254: R72.2 R73.2 113.97,15.16 112.22,13.41 112.22,12.14 110.24,10.16 J10.1
N$78
  Top 0.254: R74.2 R72.1 115.75,15.32 113.51,13.08 J10.2
N$79
  Top 0.254: R73.1 113.97,18.57 114.48,19.07 U10.5
N$80
  Top 0.254: R74.1 114.73,18.47 114.86,18.59 115.82,18.59 | 115.82,18.59 116.48,18.59 116.76,18.31 R75.2 | 115.82,18.59 115.82,20.26 U10.6
N$81  (via drill 0.3)
  Top 0.254: U10.3 v111.94,18.77 R79.1 | R76.1 117.78,18.72 v117.75,18.75
  Bottom 0.254: v111.94,18.77 111.96,18.75 v117.75,18.75
N$82  (via drill 0.35)
  Top 0.254: R78.1 109.21,20.52 U10.1 109.4,22.43 110.64,23.67 v114.4,23.67 | v114.4,29.18 114.4,28.22 R80.2
  Bottom 0.254: v114.4,23.67 v114.4,29.18
N$83
  Top 0.254: VR13.2 102.92,27.99 103.38,28.45 110.74,28.45 111.94,27.25 U10.12
N$84
  Top 0.254: R82.2 106.1,26.32 VR13.3
N$85
  Top 0.254: R77.1 R78.2 107.52,21.54 107.31,21.34 107.31,19.68 108.33,18.67 110.24,18.67 110.67,19.1 U10.2
N$86
  Top 0.254: R80.1 U10.10
N$87  (via drill 0.3)
  Top 0.254: 106.26,19.71 VR14.1 106.1,19.55 R81.1 106.15,18.29 v107.14,18.29 | v115.77,22.1 115.77,25.26 U10.9
  Bottom 0.254: v107.14,18.29 107.14,20.98 108.25,22.1 v115.77,22.1
N$89
  Top 0.381: MD1.22 38.86,75.6 J6.1
N$90
  Top 0.381: MD1.23 36.48,80.11 J6.2
RESET  (via drill 0.35)
  Top 0.203: IC2.18 74.52,53.86 74.89,54.23 81.34,54.23 v82.92,52.66 86.07,52.66 89.26,49.47 89.26,43.2 U5.11
  Bottom 0.203: v82.92,52.66 82.92,67.3 78.56,71.65 35.94,71.65 33.94,73.65 MD1.24
ROM_CS
  Top 0.203: R4.1 66.6,62.43 | 66.6,62.43 U7.1 | MD1.14 56.8,58.96 60.27,62.43 66.6,62.43
RXD
  Top 0.381: IC2.14 82.62,47.21 82.92,46.92 82.92,44.57 83.3,44.19 R10.1
SCL  (via drill 0.35)
  Top 0.203: IC2.12 83.4,43.41 84.15,42.66 v84.15,40.84 R7.1 87.15,40.84 U5.19
  Bottom 0.203: v84.15,40.84 84.15,66.77 78.82,72.11 43.51,72.11 41.56,74.06 MD1.21
SD_CS  (via drill 0.3)
  Top 0.203: R3.1 74.62,65.08 J2.2 74.55,66.65 v74.55,68.33
  Bottom 0.203: MD1.13 54.26,60.23 62.36,68.33 v74.55,68.33
SDA  (via drill 0.35)
  Top 0.203: IC2.9 77.86,37.28 v84.79,37.28 85.45,37.28 85.47,37.25 86.41,37.25 87.19,38.03 R6.1 87.19,40.01 U5.20
  Bottom 0.203: v84.79,37.28 84.79,66.67 78.87,72.59 45.31,72.59 44.1,73.81 MD1.20
TACHO
  Top 0.203: MD1.10 46.64,53.31 47.62,52.32 60.07,52.32 62.8,55.05 105.21,55.05 107.52,57.35 J3.4
UA1
  Top 0.254: R20.1 R21.2 61.06,17.12 61.47,17.53 61.47,19.86 60.84,20.49 U4.7
UA2
  Top 0.254: R31.1 R32.2 79.76,17.07 80.31,17.63 80.31,19.81 79.69,20.44 U6.7
UA3
  Top 0.254: U8.7 98.64,20.28 99.47,19.46 99.47,17.32 99.06,16.92 R54.2 R53.1
UA4
  Top 0.254: R75.1 R76.2 118.52,17.7 118.52,19.71 117.89,20.33 U10.7
UB1
  Top 0.254: R22.2 51.16,24.84 51.75,25.44 U4.14 U4.13
UB2
  Top 0.254: U6.13 U6.14 70.65,25.39 70.03,24.77 R33.2
UB3
  Top 0.254: R55.2 89.15,24.54 89.85,25.23 U8.14 U8.13
UB4
  Top 0.254: R77.2 108.13,24.56 108.85,25.28 U10.14 U10.13
V0  (via drill 0.3)
  Top 0.203: MD1.3 28.86,51.48 30.68,49.66 44.18,49.66 52.05,41.78 52.05,31.19 54.67,28.57 TP5.P$1
  Top 0.254: 45.85,20.78 VR4.2 48.4,20.68 VR4.3 49.25,22.89 v49.12,23.01 | v59.99,23.01 59.99,25.39 U4.8 60.05,28.55 TP5.P$1
  Bottom 0.254: v59.99,23.01 v49.12,23.01
V1  (via drill 0.3)
  Top 0.203: MD1.4 31.4,50.97 32.36,50.01 44.32,50.01 52.41,41.93 52.41,31.34 53.47,30.28 77.17,30.28 TP7.P$1
  Top 0.254: VR6.2 67.27,20.62 VR6.3 68.12,23.04 v68.17,23.09 | v78.89,23.16 78.89,25.36 U6.8 78.99,25.46 TP7.P$1
  Bottom 0.254: v68.17,23.09 78.82,23.09 v78.89,23.16
V2  (via drill 0.3)
  Top 0.203: MD1.5 33.94,50.95 34.52,50.37 44.47,50.37 52.76,42.08 52.76,31.49 53.59,30.65 96.59,30.65 96.6,30.66 98.04,29.21 TP6.P$1
  Top 0.254: VR10.2 86.4,20.47 VR10.3 87.25,22.86 v87.27,22.89 | TP6.P$1 U8.8 v98.04,22.81
  Bottom 0.254: v87.27,22.89 87.35,22.81 v98.04,22.81
V3  (via drill 0.3)
  Top 0.203: MD1.6 36.48,51.35 37.11,50.72 44.62,50.72 53.12,42.23 53.12,31.67 53.78,31.01 96.44,31.01 96.45,31.01 114.45,31.01 117.02,28.45 117.02,28.14
  Top 0.254: TP8.P$1 117.02,28.37 117.02,28.14 U10.8 117.04,25.26 v117.04,22.81 | VR14.2 105.37,20.52 VR14.3 106.22,22.79 v106.2,22.81
  Bottom 0.254: v106.2,22.81 v117.04,22.81
VBCKP
  Top 0.381: IC2.3 67.61,45 C14.1 64.25,45.2 59.37,50.09 BATT1.P$2
VIN
  Top 0.762: R39.2 29.46,11.75 27.91,10.21 J11.1
  pour Top (no thermals): 13.72,32.26 14.99,32.26 14.99,33.15 13.59,33.15 12.83,33.91 8.51,33.91 6.35,31.75 6.35,8.26 8.89,5.71 27.43,5.71 29.34,7.62 29.34,10.92 28.57,11.68 25.53,11.68 24,10.16 24,8.38 23.37,7.75 18.16,7.75 16.76,9.14 16.76,14.61 15.88,15.49 10.54,15.49 9.53,16.51 9.53,21.72 8.51,22.73 8.51,32 9.58,33.07 12.9,33.07
X
  Top 0.254: Q1.3 43.98,15.2 R41.2 R42.1

## Text on the board
tPlace: 3.3V | 5V | GND | Tx | Rx | GND | 24V | A6 | 24V | 5V | 3.3V | GND | 3.3V | D2 | GND | D3 | GND | 3.3V | 5V | 24V | E:/amr design eagle cat/MKR_IMU_GPS c/step file/FlatLogo_Black_PNG.bmp | Designed By / Abu Sakib Mozumder | V0 | V1 | V2 | V3 | 4-20mA | 4-20mA | 4-20mA | 4-20mA | VIN | GND | 24V | 24V | 24V | 24V | Sensor Motherboard / V-1.0, (01/31/2022) | VIN_MAX= 36V